# Altium schematic sheet p7_power.SchDoc
size A4; Organization: ORGANIZATION; Address1: ADDRESS 1; Address2: ADDRESS 2; Address3: ADDRESS 3; Address4: ADDRESS 4; Revision: Rev. A; SheetNumber: 7; SheetTotal: 8; ENG_APP_DATE: --/--/--; DSN_APP_DATE: --/--/--; CHK_APP_DATE: --/--/--
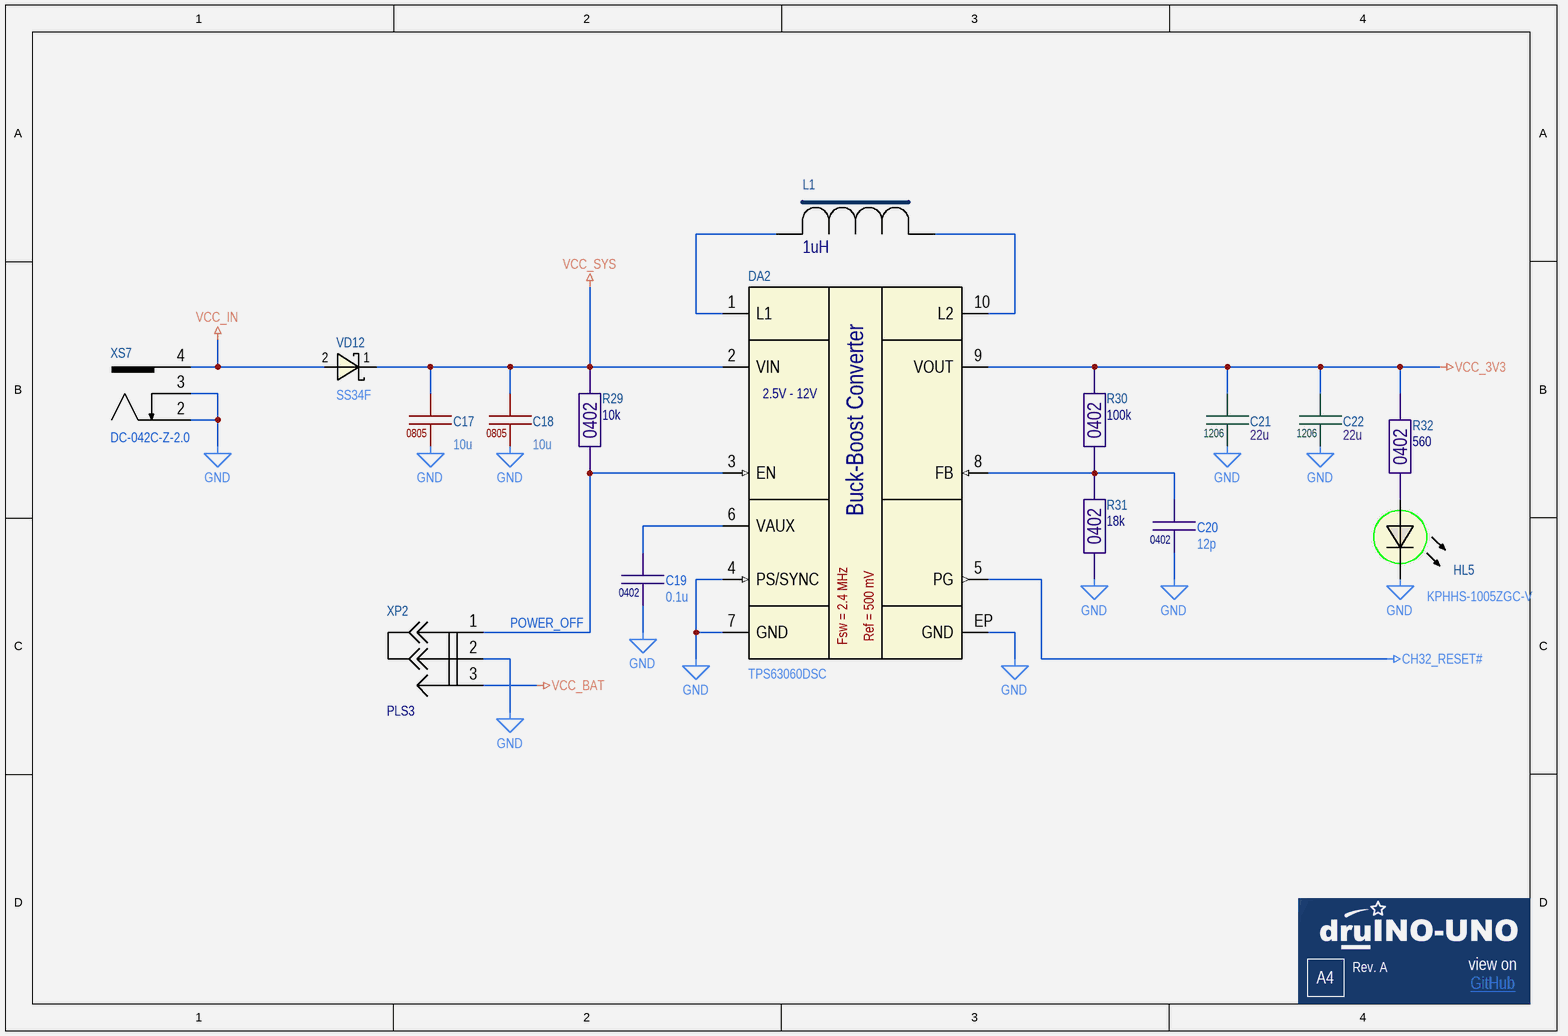
[diagram p0: p7_power.SchDoc]

## Parts
C17  10u  Package: 0805  [CAP0805-0.75]
C18  10u  Package: 0805  [CAP0805-0.75]
C19  0.1u  Package: 0402  [CAP0402]
C20  12p  Package: 0402  [CAP0402]
C21  22u  Package: 1206  [CAP1206-1.8]
C22  22u  Package: 1206  [CAP1206-1.8]
DA2  TPS63060DSC  [PWSON-10]
HL5  KPHHS-1005ZGC-V  [LED0402G525]
L1  Inductance @ 100 kHz: 1uH  [IHLP1616]  (hidden comment: IHLP2020BZERR22M01)
R29  10k  Package: 0402  [RES0402B]
R30  100k  Package: 0402  [RES0402B]
R31  18k  Package: 0402  [RES0402B]
R32  560  Package: 0402  [RES0402B]
VD12  SS34F  [SMA-FL]
XP2  PLS3  [PLS-3]
XS7  DC-042C-Z-2.0  [DC-042C-Z-2.0]

## Nets
CH32_RESET#: DA2.5(PG)
GND: C17.1 C18.1 C19.2 C20.2 C21.1 C22.1 DA2.4(PS/SYNC) DA2.7(GND) DA2.EP(GND) HL5.1 R31.2 XP2.2 XS7.2 XS7.3
VCC_3V3: C21.2 C22.2 DA2.9(VOUT) R30.1 R32.2
VCC_BAT: XP2.3
VCC_IN: VD12.2 XS7.4
VCC_SYS: C17.2 C18.2 DA2.2(VIN) R29.1 VD12.1
POWER_OFF: DA2.3(EN) R29.2 XP2.1
NetC19_1: C19.1 DA2.6(VAUX)
NetC20_1: C20.1 DA2.8(FB) R30.2 R31.1
NetDA2_1: DA2.1(L1) L1.1
NetDA2_10: DA2.10(L2) L1.2
NetHL5_2: HL5.2 R32.1

## Notes on the sheet
- A4
- GitHub <https://github.com/kirra-cat/druino-uno>
- view on
- (in symbol TPS63060DSC) 2.5V - 12V; Buck-Boost Converter; Fsw = 2.4 MHz; Ref = 500 mV

## Library data of the parts
C17 C18 = C0805: Capacitors 0805 package case; Part Number: TCC0805X7R106K250FT; Manufacturer: CCTC; Tolerance: ± 10 %; Dielectric: X7R; Voltage: 25V; Value: 10u; Value on schem: 10u
C19 = C0402: Capacitors 0402 package case; Part Number: TCC0402X7R104J500AT; Manufacturer: CCTC; Tolerance: ± 5 %; Dielectric: X7R; Voltage: 50 V; Value: 0.1u; Value on schem: 0.1u
C20 = C0402: Capacitors 0402 package case; Part Number: TCC0402COG120F500AT; Manufacturer: CCTC; Tolerance: ± 1 %; Dielectric: NP0; Voltage: 50 V; Value: 12p; Value on schem: 12p
C21 C22 = C1206: Capacitors 1206 package case; Part Number: TCC1206X7R226M160HT; Manufacturer: CCTC; Tolerance: ± 20 %; Dielectric: X7R; Voltage: 16V; Value: 22u; Value on schem: 22u
DA2 = TPS63060DSC: High Input Voltage, 2A Buck-Boost Converter; Manufacturer: Texas Instruments; Part Number: TPS63060DSC; Package: PWSON-10
HL5 = KPHHS-1005ZGC-V: Green led (package case 0402); Manufacturer: Kingbright Company LLC.; Designator: HL*; Forward Current: 20 mA; Forward Voltage: 3.3V; Wavelength: 515 nm; Package: 0402; Part Number: KPHHS-1005ZGC-V; Color: Green
L1 = IHLP1616BZER1R0M01: Shielded SMD Power Inductors; Manufacturer: Vishay Dale; RDC: 27 mOhm; SRF Min: 64 MHz; Irms  Max: 4.5 A; Isat  Typ: 5 A; Part Number: IHLP2020BZERR22M01; Package: 4.06mm x 4.06mm
R29 = R0402: Resistor 0402 package case; Part Number: RC0402FR-0710KL; Manufacturer: Yageo; Tolerance: ± 1 %; Temperature Coefficient: ±100 ppm/K; Value: 10k; Value on schem: 10k
R30 = R0402: Resistor 0402 package case; Part Number: RC0402FR-07100KL; Manufacturer: Yageo; Tolerance: ± 1 %; Temperature Coefficient: ±100 ppm/K; Value: 100k; Value on schem: 100k
R31 = R0402: Resistor 0402 package case; Part Number: RC0402FR-0718KL; Manufacturer: Yageo; Tolerance: ± 1 %; Temperature Coefficient: ±100 ppm/K; Value: 18k; Value on schem: 18k
R32 = R0402: Resistor 0402 package case; Part Number: RC0402FR-07560RL; Manufacturer: Yageo; Tolerance: ± 1 %; Temperature Coefficient: ±100 ppm/K; Value: 560; Value on schem: 560
VD12 = SS34F: 3A Schottky barrier rectifier; Manufacturer: UMW; Package: SMAF; Part Number: SS34F
XS7 = DC-042C-Z-2.0: Shrouded DC Power Receptacle 2mm 6.3mm 8A 24V; Manufacturer: XKB Connectivity; Part Number: DC-042C-Z-2.0
XP2 = PLS3: Value: PLS3